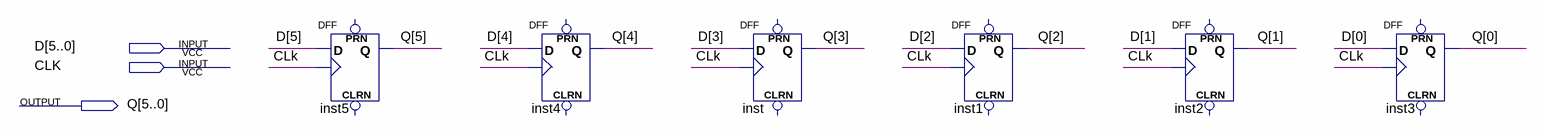
[diagram p0: schematic sheet]
// Quartus schematic DFF_6bit.bdf as structural Verilog: 6 symbols, 3 pins
module DFF_6bit (
  input  [5:0] D,
  input  CLK,
  output [5:0] Q
);

  DFF inst5 (.CLK(CLK), .D(D[5]), .Q(Q[5]));  // open: CLRN, PRN
  DFF inst4 (.CLK(CLK), .D(D[4]), .Q(Q[4]));  // open: CLRN, PRN
  DFF inst (.CLK(CLK), .D(D[3]), .Q(Q[3]));  // open: CLRN, PRN
  DFF inst1 (.CLK(CLK), .D(D[2]), .Q(Q[2]));  // open: CLRN, PRN
  DFF inst2 (.CLK(CLK), .D(D[1]), .Q(Q[1]));  // open: CLRN, PRN
  DFF inst3 (.CLK(CLK), .D(D[0]), .Q(Q[0]));  // open: CLRN, PRN
endmodule
